# EAGLE design EIB_96Ch_YO (EAGLE 9.6.2)
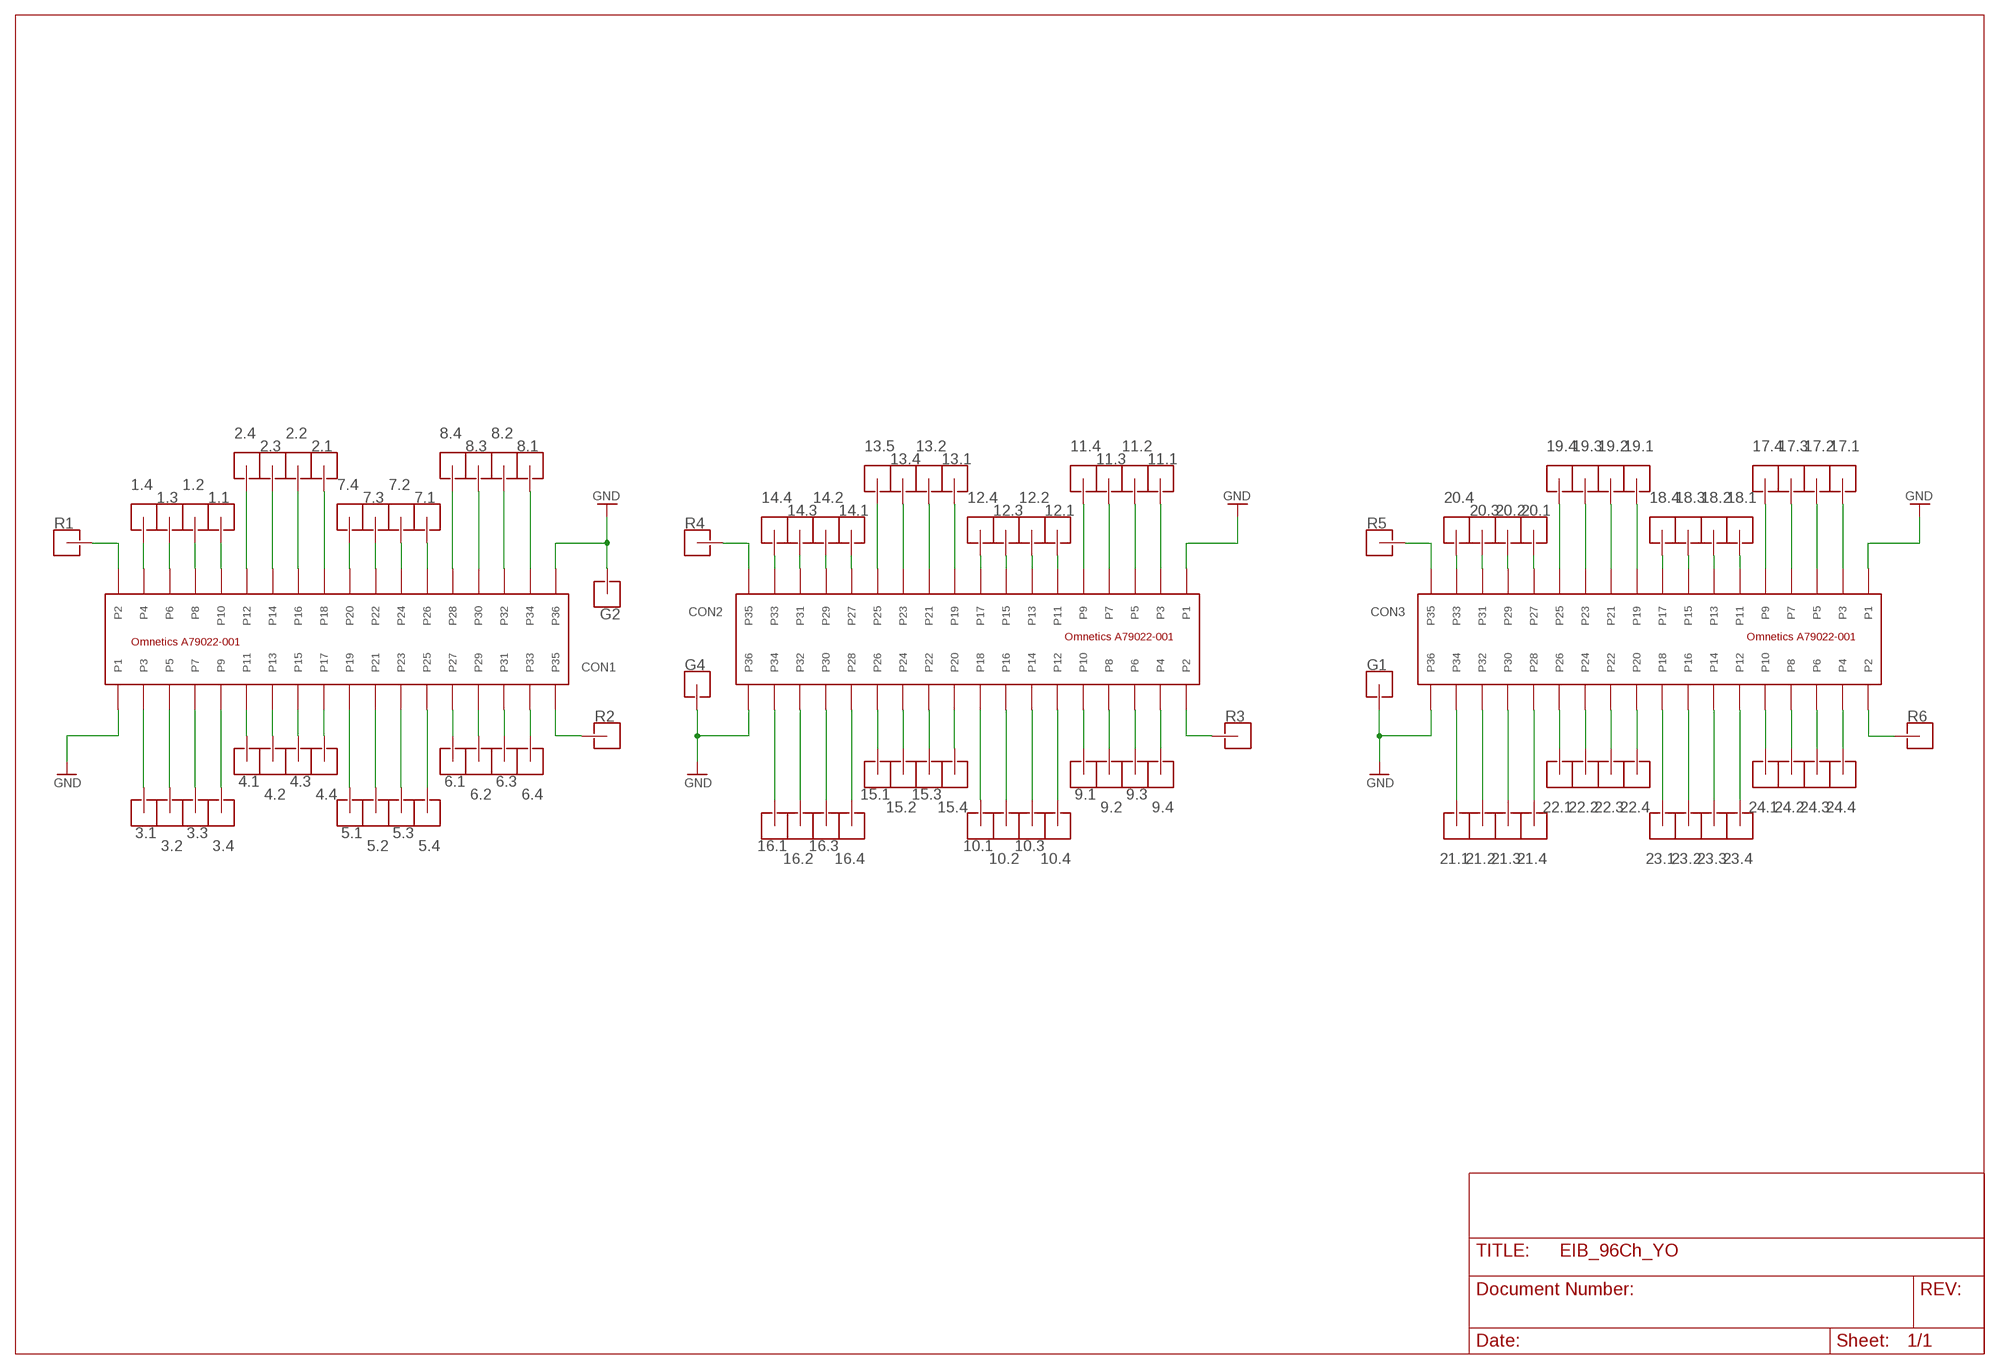
[diagram p0: schematic, sheet 1]

## Parts
1.1  HOLE_L_G_PIN_V5  [LARGE_GOLD_PIN_V5]
1.2  HOLE_L_G_PIN_V5  [LARGE_GOLD_PIN_V5]
1.3  HOLE_L_G_PIN_V5  [LARGE_GOLD_PIN_V5]
1.4  HOLE_L_G_PIN_V5  [LARGE_GOLD_PIN_V5]
2.1  HOLE_L_G_PIN_V5  [LARGE_GOLD_PIN_V5]
2.2  HOLE_L_G_PIN_V5  [LARGE_GOLD_PIN_V5]
2.3  HOLE_L_G_PIN_V5  [LARGE_GOLD_PIN_V5]
2.4  HOLE_L_G_PIN_V5  [LARGE_GOLD_PIN_V5]
3.1  HOLE_L_G_PIN_V5  [LARGE_GOLD_PIN_V5]
3.2  HOLE_L_G_PIN_V5  [LARGE_GOLD_PIN_V5]
3.3  HOLE_L_G_PIN_V5  [LARGE_GOLD_PIN_V5]
3.4  HOLE_L_G_PIN_V5  [LARGE_GOLD_PIN_V5]
4.1  HOLE_L_G_PIN_V5  [LARGE_GOLD_PIN_V5]
4.2  HOLE_L_G_PIN_V5  [LARGE_GOLD_PIN_V5]
4.3  HOLE_L_G_PIN_V5  [LARGE_GOLD_PIN_V5]
4.4  HOLE_L_G_PIN_V5  [LARGE_GOLD_PIN_V5]
5.1  HOLE_L_G_PIN_V5  [LARGE_GOLD_PIN_V5]
5.2  HOLE_L_G_PIN_V5  [LARGE_GOLD_PIN_V5]
5.3  HOLE_L_G_PIN_V5  [LARGE_GOLD_PIN_V5]
5.4  HOLE_L_G_PIN_V5  [LARGE_GOLD_PIN_V5]
6.1  HOLE_L_G_PIN_V5  [LARGE_GOLD_PIN_V5]
6.2  HOLE_L_G_PIN_V5  [LARGE_GOLD_PIN_V5]
6.3  HOLE_L_G_PIN_V5  [LARGE_GOLD_PIN_V5]
6.4  HOLE_L_G_PIN_V5  [LARGE_GOLD_PIN_V5]
7.1  HOLE_L_G_PIN_V5  [LARGE_GOLD_PIN_V5]
7.2  HOLE_L_G_PIN_V5  [LARGE_GOLD_PIN_V5]
7.3  HOLE_L_G_PIN_V5  [LARGE_GOLD_PIN_V5]
7.4  HOLE_L_G_PIN_V5  [LARGE_GOLD_PIN_V5]
8.1  HOLE_L_G_PIN_V5  [LARGE_GOLD_PIN_V5]
8.2  HOLE_L_G_PIN_V5  [LARGE_GOLD_PIN_V5]
8.3  HOLE_L_G_PIN_V5  [LARGE_GOLD_PIN_V5]
8.4  HOLE_L_G_PIN_V5  [LARGE_GOLD_PIN_V5]
9.1  HOLE_L_G_PIN_V5  [LARGE_GOLD_PIN_V5]
9.2  HOLE_L_G_PIN_V5  [LARGE_GOLD_PIN_V5]
9.3  HOLE_L_G_PIN_V5  [LARGE_GOLD_PIN_V5]
9.4  HOLE_L_G_PIN_V5  [LARGE_GOLD_PIN_V5]
10.1  HOLE_L_G_PIN_V5  [LARGE_GOLD_PIN_V5]
10.2  HOLE_L_G_PIN_V5  [LARGE_GOLD_PIN_V5]
10.3  HOLE_L_G_PIN_V5  [LARGE_GOLD_PIN_V5]
10.4  HOLE_L_G_PIN_V5  [LARGE_GOLD_PIN_V5]
11.1  HOLE_L_G_PIN_V5  [LARGE_GOLD_PIN_V5]
11.2  HOLE_L_G_PIN_V5  [LARGE_GOLD_PIN_V5]
11.3  HOLE_L_G_PIN_V5  [LARGE_GOLD_PIN_V5]
11.4  HOLE_L_G_PIN_V5  [LARGE_GOLD_PIN_V5]
12.1  HOLE_L_G_PIN_V5  [LARGE_GOLD_PIN_V5]
12.2  HOLE_L_G_PIN_V5  [LARGE_GOLD_PIN_V5]
12.3  HOLE_L_G_PIN_V5  [LARGE_GOLD_PIN_V5]
12.4  HOLE_L_G_PIN_V5  [LARGE_GOLD_PIN_V5]
13.1  HOLE_L_G_PIN_V5  [LARGE_GOLD_PIN_V5]
13.2  HOLE_L_G_PIN_V5  [LARGE_GOLD_PIN_V5]
13.4  HOLE_L_G_PIN_V5  [LARGE_GOLD_PIN_V5]
13.5  HOLE_L_G_PIN_V5  [LARGE_GOLD_PIN_V5]
14.1  HOLE_L_G_PIN_V5  [LARGE_GOLD_PIN_V5]
14.2  HOLE_L_G_PIN_V5  [LARGE_GOLD_PIN_V5]
14.3  HOLE_L_G_PIN_V5  [LARGE_GOLD_PIN_V5]
14.4  HOLE_L_G_PIN_V5  [LARGE_GOLD_PIN_V5]
15.1  HOLE_L_G_PIN_V5  [LARGE_GOLD_PIN_V5]
15.2  HOLE_L_G_PIN_V5  [LARGE_GOLD_PIN_V5]
15.3  HOLE_L_G_PIN_V5  [LARGE_GOLD_PIN_V5]
15.4  HOLE_L_G_PIN_V5  [LARGE_GOLD_PIN_V5]
16.1  HOLE_L_G_PIN_V5  [LARGE_GOLD_PIN_V5]
16.2  HOLE_L_G_PIN_V5  [LARGE_GOLD_PIN_V5]
16.3  HOLE_L_G_PIN_V5  [LARGE_GOLD_PIN_V5]
16.4  HOLE_L_G_PIN_V5  [LARGE_GOLD_PIN_V5]
17.1  HOLE_L_G_PIN_V5  [LARGE_GOLD_PIN_V5]
17.2  HOLE_L_G_PIN_V5  [LARGE_GOLD_PIN_V5]
17.3  HOLE_L_G_PIN_V5  [LARGE_GOLD_PIN_V5]
17.4  HOLE_L_G_PIN_V5  [LARGE_GOLD_PIN_V5]
18.1  HOLE_L_G_PIN_V5  [LARGE_GOLD_PIN_V5]
18.2  HOLE_L_G_PIN_V5  [LARGE_GOLD_PIN_V5]
18.3  HOLE_L_G_PIN_V5  [LARGE_GOLD_PIN_V5]
18.4  HOLE_L_G_PIN_V5  [LARGE_GOLD_PIN_V5]
19.1  HOLE_L_G_PIN_V5  [LARGE_GOLD_PIN_V5]
19.2  HOLE_L_G_PIN_V5  [LARGE_GOLD_PIN_V5]
19.3  HOLE_L_G_PIN_V5  [LARGE_GOLD_PIN_V5]
19.4  HOLE_L_G_PIN_V5  [LARGE_GOLD_PIN_V5]
20.1  HOLE_L_G_PIN_V5  [LARGE_GOLD_PIN_V5]
20.2  HOLE_L_G_PIN_V5  [LARGE_GOLD_PIN_V5]
20.3  HOLE_L_G_PIN_V5  [LARGE_GOLD_PIN_V5]
20.4  HOLE_L_G_PIN_V5  [LARGE_GOLD_PIN_V5]
21.1  HOLE_L_G_PIN_V5  [LARGE_GOLD_PIN_V5]
21.2  HOLE_L_G_PIN_V5  [LARGE_GOLD_PIN_V5]
21.3  HOLE_L_G_PIN_V5  [LARGE_GOLD_PIN_V5]
21.4  HOLE_L_G_PIN_V5  [LARGE_GOLD_PIN_V5]
22.1  HOLE_L_G_PIN_V5  [LARGE_GOLD_PIN_V5]
22.2  HOLE_L_G_PIN_V5  [LARGE_GOLD_PIN_V5]
22.3  HOLE_L_G_PIN_V5  [LARGE_GOLD_PIN_V5]
22.4  HOLE_L_G_PIN_V5  [LARGE_GOLD_PIN_V5]
23.1  HOLE_L_G_PIN_V5  [LARGE_GOLD_PIN_V5]
23.2  HOLE_L_G_PIN_V5  [LARGE_GOLD_PIN_V5]
23.3  HOLE_L_G_PIN_V5  [LARGE_GOLD_PIN_V5]
23.4  HOLE_L_G_PIN_V5  [LARGE_GOLD_PIN_V5]
24.1  HOLE_L_G_PIN_V5  [LARGE_GOLD_PIN_V5]
24.2  HOLE_L_G_PIN_V5  [LARGE_GOLD_PIN_V5]
24.3  HOLE_L_G_PIN_V5  [LARGE_GOLD_PIN_V5]
24.4  HOLE_L_G_PIN_V5  [LARGE_GOLD_PIN_V5]
CON1  A79022-001_MALESMD  [A79026-001_MALE]
CON2  A79022-001_MALESMD  [A79026-001_MALE]
CON3  A79022-001_MALESMD  [A79026-001_MALE]
G1  HOLE_L_G_PIN_V5  [LARGE_GOLD_PIN_V5]
G2  HOLE_L_G_PIN_V5  [LARGE_GOLD_PIN_V5]
G4  HOLE_L_G_PIN_V5  [LARGE_GOLD_PIN_V5]
R1  HOLE_L_G_PIN_V5  [LARGE_GOLD_PIN_V5]
R2  HOLE_L_G_PIN_V5  [LARGE_GOLD_PIN_V5]
R3  HOLE_L_G_PIN_V5  [LARGE_GOLD_PIN_V5]
R4  HOLE_L_G_PIN_V5  [LARGE_GOLD_PIN_V5]
R5  HOLE_L_G_PIN_V5  [LARGE_GOLD_PIN_V5]
R6  HOLE_L_G_PIN_V5  [LARGE_GOLD_PIN_V5]

## Nets
GND: CON1.P1 CON1.P36 CON2.P1 CON2.P36 CON3.P1 CON3.P36 G1.P$1 G2.P$1 G4.P$1
N$1: 11.2.P$1 CON2.P5
N$2: 11.3.P$1 CON2.P7
N$3: 11.4.P$1 CON2.P9
N$4: 14.4.P$1 CON2.P33
N$5: 16.2.P$1 CON2.P32
N$6: 16.1.P$1 CON2.P34
N$7: 12.1.P$1 CON2.P11
N$8: 16.3.P$1 CON2.P30
N$9: 12.4.P$1 CON2.P17
N$10: 13.1.P$1 CON2.P19
N$11: 15.4.P$1 CON2.P20
N$12: 10.4.P$1 CON2.P12
N$13: 12.2.P$1 CON2.P13
N$14: 12.3.P$1 CON2.P15
N$15: 13.2.P$1 CON2.P21
N$16: 13.4.P$1 CON2.P23
N$17: 13.5.P$1 CON2.P25
N$18: 14.1.P$1 CON2.P27
N$19: 14.2.P$1 CON2.P29
N$20: 14.3.P$1 CON2.P31
N$21: 10.1.P$1 CON2.P18
N$22: 11.1.P$1 CON2.P3
N$23: 9.4.P$1 CON2.P4
N$24: 9.3.P$1 CON2.P6
N$25: 9.2.P$1 CON2.P8
N$26: 10.3.P$1 CON2.P14
N$27: 10.2.P$1 CON2.P16
N$28: 9.1.P$1 CON2.P10
N$29: 16.4.P$1 CON2.P28
N$30: 15.1.P$1 CON2.P26
N$31: 15.3.P$1 CON2.P22
N$32: 15.2.P$1 CON2.P24
N$33: CON1.P2 R1.P$1
N$34: CON2.P2 R3.P$1
N$35: CON2.P35 R4.P$1
N$36: CON1.P35 R2.P$1
N$37: 3.2.P$1 CON1.P5
N$38: 3.3.P$1 CON1.P7
N$39: 3.4.P$1 CON1.P9
N$40: 4.1.P$1 CON1.P11
N$41: 4.2.P$1 CON1.P13
N$42: 4.3.P$1 CON1.P15
N$43: 5.2.P$1 CON1.P21
N$44: 5.3.P$1 CON1.P23
N$45: 5.4.P$1 CON1.P25
N$46: 7.4.P$1 CON1.P20
N$47: 7.3.P$1 CON1.P22
N$48: 7.2.P$1 CON1.P24
N$49: 4.4.P$1 CON1.P17
N$50: 5.1.P$1 CON1.P19
N$51: 7.1.P$1 CON1.P26
N$52: 2.1.P$1 CON1.P18
N$53: 3.1.P$1 CON1.P3
N$54: 1.4.P$1 CON1.P4
N$55: 1.3.P$1 CON1.P6
N$56: 1.2.P$1 CON1.P8
N$57: 2.4.P$1 CON1.P12
N$58: 2.3.P$1 CON1.P14
N$59: 2.2.P$1 CON1.P16
N$60: 1.1.P$1 CON1.P10
N$61: 6.4.P$1 CON1.P33
N$62: 6.1.P$1 CON1.P27
N$63: 6.2.P$1 CON1.P29
N$64: 6.3.P$1 CON1.P31
N$65: 8.1.P$1 CON1.P34
N$66: 8.2.P$1 CON1.P32
N$67: 8.3.P$1 CON1.P30
N$68: 8.4.P$1 CON1.P28
N$69: 20.4.P$1 CON3.P33
N$70: CON3.P35 R5.P$1
N$71: 20.3.P$1 CON3.P31
N$72: 20.2.P$1 CON3.P29
N$73: 20.1.P$1 CON3.P27
N$74: 19.4.P$1 CON3.P25
N$75: 19.3.P$1 CON3.P23
N$76: 19.2.P$1 CON3.P21
N$77: 19.1.P$1 CON3.P19
N$78: 18.4.P$1 CON3.P17
N$79: 18.3.P$1 CON3.P15
N$80: 18.2.P$1 CON3.P13
N$81: 18.1.P$1 CON3.P11
N$82: 17.4.P$1 CON3.P9
N$83: 17.3.P$1 CON3.P7
N$84: 17.2.P$1 CON3.P5
N$85: 17.1.P$1 CON3.P3
N$87: CON3.P2 R6.P$1
N$88: 24.4.P$1 CON3.P4
N$89: 24.3.P$1 CON3.P6
N$90: 24.2.P$1 CON3.P8
N$91: 24.1.P$1 CON3.P10
N$92: 23.4.P$1 CON3.P12
N$93: 23.3.P$1 CON3.P14
N$94: 23.2.P$1 CON3.P16
N$95: 23.1.P$1 CON3.P18
N$96: 22.4.P$1 CON3.P20
N$98: 22.3.P$1 CON3.P22
N$99: 22.2.P$1 CON3.P24
N$100: 22.1.P$1 CON3.P26
N$101: 21.4.P$1 CON3.P28
N$102: 21.3.P$1 CON3.P30
N$103: 21.2.P$1 CON3.P32
N$104: 21.1.P$1 CON3.P34

## Library data of the parts
1.1-1.4 2.1-2.4 3.1-3.4 4.1-4.4 5.1-5.4 6.1-6.4 7.1-7.4 8.1-8.4 9.1-9.4 10.1-10.4 11.1-11.4 12.1-12.4 13.1 13.2 13.4 13.5 14.1-14.4 15.1-15.4 16.1-16.4 17.1-17.4 18.1-18.4 19.1-19.4 20.1-20.4 21.1-21.4 22.1-22.4 23.1-23.4 24.1-24.4 G1 G2 G4 R1-R6 = pin and holes:HOLE
CON1-CON3 = omnetics:A79022-001_MALE

## Board
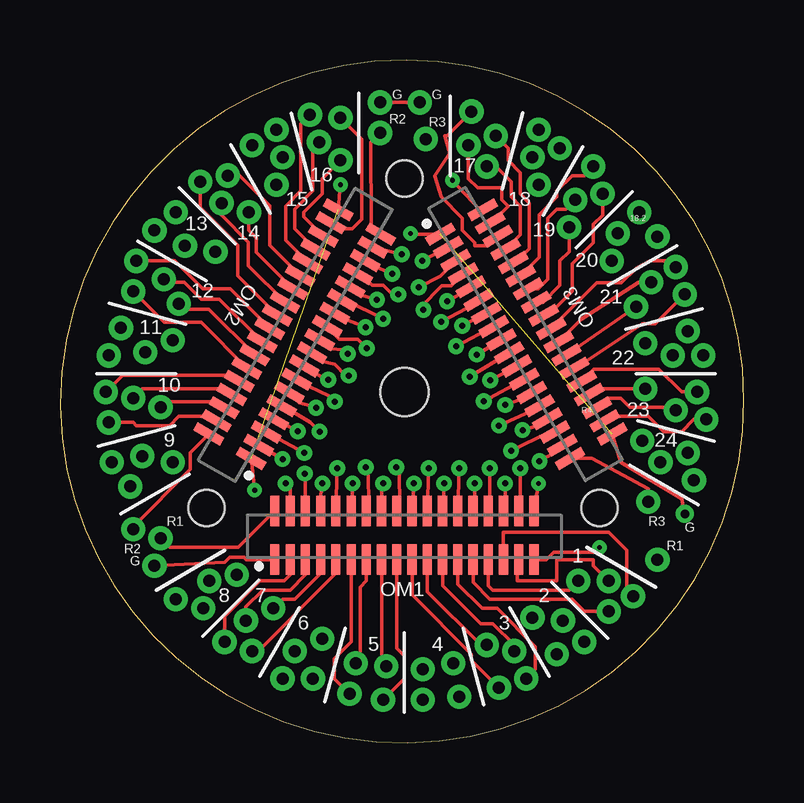
[diagram p1: board, top side]
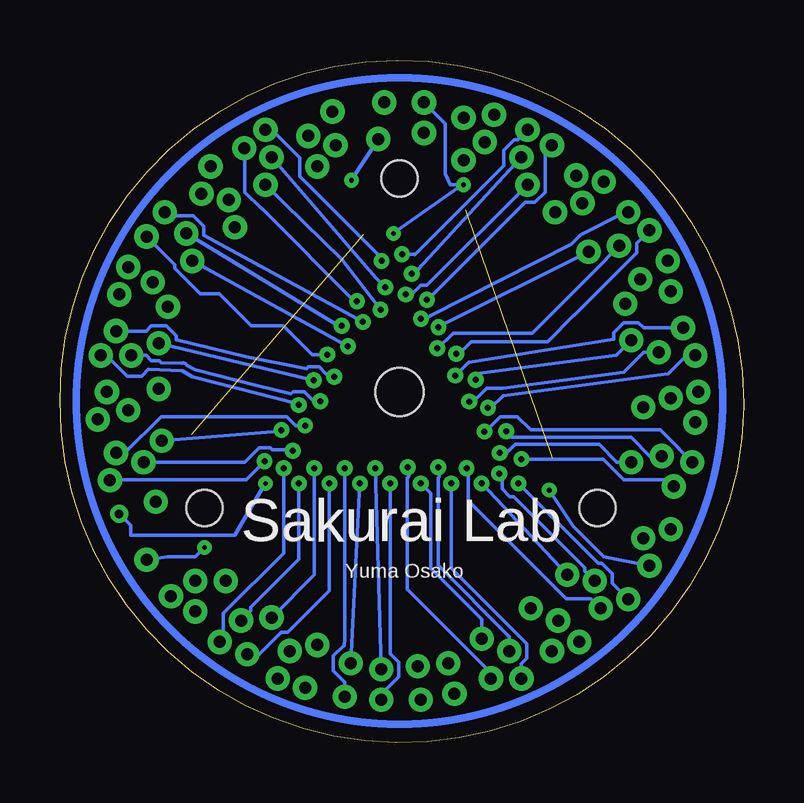
[diagram p2: board, bottom side, seen from below]

Size 28.5 x 28.44 mm. Coordinates in mm from the lower left corner, seen from the top.
Outline: 14.45,28.44 arc90 0,14.11 0,13.98 arc90 14.49,0 arc90 28.5,14.26 arc90 14.45,28.44
Copper layers (1*16): Top 0.035mm / dielectric 1.5mm / Bottom 0.035mm
Design rules "default": minimum track width 6mil, minimum drill 0.35mm, track to track 6mil, track to pad 6mil, pad to pad 6mil, via to via 6mil, smd to smd 6mil, copper to edge 40mil, drill to drill 6mil, minimum pad ring 10mil, minimum via ring 8mil, stop-mask expansion 4mil, vias tented up to drill 0mil, thermal gap 10mil
Holes 2 mm at 14.35,14.6
Holes 1.5 mm at 6.1,9.78 22.48,9.78 14.35,23.49

### Footprints (pad centres in the part's own frame; a part is rotated, then mirrored left to right if it is on the bottom)
LARGE_GOLD_PIN_V5 = drill 0.5 pad 0.8: P$1 0,0
A79026-001_MALE = smd 0.381 x 1.27: P1 -5.397,-1.016; P2 -5.397,1.016; P3 -4.763,-1.016; P4 -4.763,1.016; P5 -4.128,-1.016; P6 -4.128,1.016; P7 -3.493,-1.016; P8 -3.493,1.016; P9 -2.857,-1.016; P10 -2.857,1.016; P11 -2.223,-1.016; P12 -2.223,1.016; P13 -1.587,-1.016; P14 -1.587,1.016; P15 -0.953,-1.016; P16 -0.953,1.016; P17 -0.318,-1.016; P18 -0.318,1.016; P19 0.318,-1.016; P20 0.318,1.016; P21 0.953,-1.016; P22 0.953,1.016; P23 1.587,-1.016; P24 1.587,1.016; P25 2.223,-1.016; P26 2.223,1.016; P27 2.857,-1.016; P28 2.857,1.016; P29 3.493,-1.016; P30 3.493,1.016; P31 4.128,-1.016; P32 4.128,1.016; P33 4.763,-1.016; P34 4.763,1.016; P35 5.397,-1.016; P36 5.397,1.016

### Placement (x,y rotation side)
1.1  5.97,5.59 0 top
1.2  7.37,6.98 0 top
1.3  6.22,6.73 0 top
1.4  4.83,5.97 0 top
2.1  10.54,2.67 0 top
2.2  10.92,4.32 0 top
2.3  9.78,3.81 0 top
2.4  9.27,2.67 0 top
3.1  6.86,4.19 0 top
3.2  7.75,5.08 0 top
3.3  8.89,5.59 0 top
3.4  8,3.81 0 top
4.1  12.06,2.03 0 top
4.2  12.32,3.3 0 top
4.3  13.59,3.18 0 top
4.4  13.46,1.78 0 top
5.1  18.29,2.29 0 top
5.2  17.78,4.06 0 top
5.3  18.92,3.81 0 top
5.4  19.43,2.67 0 top
6.1  22.86,5.46 0 top
6.2  21.59,6.73 0 top
6.3  23.88,6.1 0 top
6.4  22.86,6.73 0 top
7.1  16.64,1.9 0 top
7.2  16.38,3.3 0 top
7.3  15.11,3.05 0 top
7.4  15.11,1.78 0 top
8.1  21.84,4.19 0 top
8.2  20.95,5.08 0 top
8.3  19.69,5.21 0 top
8.4  20.7,3.68 0 top
9.1  1.91,14.6 0 top
9.2  3.05,14.35 0 top
9.3  4.19,13.97 0 top
9.4  2.03,13.34 0 top
10.1  3.17,20.07 0 top
10.2  4.32,19.3 0 top
10.3  4.95,18.29 0 top
10.4  3.05,18.8 0 top
11.1  2.92,10.67 0 top
11.2  4.7,11.68 0 top
11.3  3.43,11.94 0 top
11.4  2.16,11.68 0 top
12.1  2.03,16.13 0 top
12.2  3.56,16.26 0 top
12.3  4.7,16.76 0 top
12.4  2.54,17.27 0 top
13.1  3.94,21.34 0 top
13.2  5.21,20.7 0 top
13.4  6.48,20.45 0 top
13.5  4.83,22.1 0 top
14.1  8,24.89 0 top
14.2  9.02,23.24 0 top
14.3  9.27,24.38 0 top
14.4  9.02,25.53 0 top
15.1  6.98,23.62 0 top
15.2  7.87,22.1 0 top
15.3  6.73,22.48 0 top
15.4  5.84,23.37 0 top
16.1  11.68,26.03 0 top
16.2  11.68,24.26 0 top
16.3  10.8,25.02 0 top
16.4  10.41,26.16 0 top
17.1  19.94,25.53 0 top
17.2  19.69,24.38 0 top
17.3  19.94,23.24 0 top
17.4  20.83,24.77 0 top
18.1  24.13,22.1 0 top
18.2  23.24,21.21 0 top
18.3  22.99,20.07 0 top
18.4  24.89,21.08 0 top
19.1  26.16,17.14 0 top
19.2  24.38,16.64 0 top
19.3  25.53,16.13 0 top
19.4  26.8,16.13 0 top
20.1  26.16,12.06 0 top
20.2  24.26,12.57 0 top
20.3  25.02,11.68 0 top
20.4  26.42,10.92 0 top
21.1  26.92,13.46 0 top
21.2  25.65,13.84 0 top
21.3  24.38,14.73 0 top
21.4  26.54,14.6 0 top
22.1  26.03,18.67 0 top
22.2  24,18.16 0 top
22.3  24.64,19.18 0 top
22.4  25.65,19.81 0 top
23.1  22.61,22.86 0 top
23.2  21.21,21.46 0 top
23.3  21.46,22.61 0 top
23.4  22.23,24 0 top
24.1  18.16,25.27 0 top
24.2  17.78,24 0 top
24.3  17.14,26.29 0 top
24.4  17.02,24.89 0 top
CON1  14.35,8.64 0 top
CON2  9.78,17.02 60 top
CON3  19.43,17.02 300 top
G1  14.99,26.67 0 top
G2  13.34,26.67 0 top
G4  3.94,7.37 0 top
R1  4.19,8.51 0 top
R2  24.89,7.62 0 top
R3  3.05,8.89 0 top
R4  13.34,25.4 0 top
R5  24.51,10.03 0 top
R6  15.24,25.15 0 top

### Tracks (layer width: path | path; a pad name or v marks a point on that pad's centre or on a via)
GND  (via drill 0.2, 0.35)  (2 unrouted)
  Top 0.152: G4.P$1 6.86,7.51 7.06,7.72 7.67,7.72 7.77,7.62 CON1.P1 | CON1.P36 v19.94,10.79 | v11.68,23.24 CON2.P36 | G2.P$1 G1.P$1 | CON3.P1 14.61,21.18 v14.6,21.21 | CON3.P36 23.37,11.68 25.91,10.16 v26.03,9.52 | CON2.P1 v8.12,10.51 v8.11,10.52
  Bottom 0.152: G2.P$1 12.45,25.78 12.45,23.69 12.23,23.24 v11.68,23.24 11.74,23.24 v14.6,21.21 | v26.03,9.52 25.55,9.04 25.55,8.64 21.21,8.64 v19.94,10.79 | v8.11,10.52 7.11,9.01 5.84,7.75 G4.P$1
N$1  (via drill 0.25)
  Top 0.152: v10.18,12.06 CON2.P5
  Bottom 0.152: 11.2.P$1 5.3,11.68 6.04,12.42 9.52,12.42 9.88,12.06 v10.18,12.06
N$2  (via drill 0.25)
  Top 0.152: v9.91,12.97 CON2.P7
  Bottom 0.152: 11.3.P$1 3.92,11.94 4.7,12.72 9.67,12.72 9.78,12.83 9.78,12.97 v9.91,12.97
N$3  (via drill 0.25)
  Top 0.152: v10.81,12.95 10.43,13.34 9.27,14.03 CON2.P9
  Bottom 0.152: 11.4.P$1 2.7,12.22 2.7,12.24 3.48,13.03 8.89,13.03 9.45,13.58 10.16,13.58 10.78,12.95 v10.81,12.95
N$4  (via drill 0.25)
  Top 0.152: v14.24,20.34 CON2.P33
  Bottom 0.152: 14.4.P$1 9.43,25.12 9.57,25.12 10,24.69 10,24.03 13.72,20.32 13.74,20.34 v14.24,20.34
N$5
  Top 0.152: 16.2.P$1 10.92,23.49 10.92,22.86 10.16,22.1 10.16,21.9 CON2.P32
N$6
  Top 0.152: 16.1.P$1 12.57,25.15 12.57,21.8 12.17,21.4 11.53,21.4 CON2.P34
N$7  (via drill 0.25)
  Top 0.152: v10.67,13.95 10.65,13.97 9.98,14.16 CON2.P11
  Bottom 0.152: 12.1.P$1 2.39,16.13 3.16,15.36 10.03,14.46 10.54,13.95 v10.67,13.95
N$8
  Top 0.152: 16.3.P$1 10.54,24.77 10.54,22.99 9.78,22.23 9.78,21.42 CON2.P30
N$9  (via drill 0.25)
  Top 0.152: v12.03,15.29 11.9,15.29 11.44,15.75 10.82,15.92 CON2.P17
  Bottom 0.152: v12.03,15.29 11.47,15.85 11.45,15.85 5.43,16.81 5.43,17.07 5,17.5 4.4,17.5 4.17,17.27 12.4.P$1
N$10  (via drill 0.25)
  Top 0.152: v11.99,16.2 11.86,16.36 11.2,16.4 CON2.P19
  Bottom 0.152: 13.1.P$1 4.47,20.8 4.47,20.4 7.06,17.81 7.08,17.81 8.19,16.71 11.36,16.71 11.86,16.2 v11.99,16.2
N$11
  Top 0.152: 15.4.P$1 5.84,22.29 7.41,20.72 7.41,19.45 CON2.P20
N$12
  Top 0.152: 10.4.P$1 4.34,17.51 5.88,17.51 CON2.P12
N$13  (via drill 0.25)
  Top 0.152: v11.45,14.2 11.2,14.46 9.96,15.04 CON2.P13
  Bottom 0.152: 12.2.P$1 4.17,16.26 5,15.42 10.05,14.76 10.71,14.76 11.12,14.35 11.45,14.35 v11.45,14.2
N$14  (via drill 0.25)
  Top 0.152: v11.18,15.11 11.15,15.09 10.26,15.6 CON2.P15
  Bottom 0.152: v11.18,15.11 11.18,15.37 5.33,16.13 12.3.P$1
N$15  (via drill 0.25)
  Top 0.152: v12.78,16.42 12.4,16.81 11.64,16.81 11.13,17.31 11.11,17.31 CON2.P21
  Bottom 0.152: 13.2.P$1 5.74,20.16 5.74,20.14 8.83,17.06 12.12,17.06 12.75,16.42 v12.78,16.42
N$16  (via drill 0.25)
  Top 0.152: v12.73,17.3 11.58,17.76 CON2.P23
  Bottom 0.152: 13.4.P$1 12.73,17.32 v12.73,17.3
N$17  (via drill 0.25)
  Top 0.152: v13.46,17.65 11.9,18.44 CON2.P25
  Bottom 0.152: 13.5.P$1 4.95,22.1 6.8,21.16 7.19,20.77 13.08,17.78 13.21,17.65 v13.46,17.65
N$18  (via drill 0.25)
  Top 0.152: v13.21,18.45 12.36,18.71 CON2.P27
  Bottom 0.152: 14.1.P$1 8.28,24.61 8.28,22.94 8.71,22.51 9.12,22.51 13.17,18.45 v13.21,18.45
N$19  (via drill 0.25)
  Top 0.152: v14.1,18.67 13.84,18.67 13.46,19.05 13.02,19.05 12.53,19.53 CON2.P29
  Bottom 0.152: 14.2.P$1 13.21,19.05 13.46,19.05 13.84,18.67 v14.1,18.67
N$20  (via drill 0.25)
  Top 0.152: v13.84,19.53 12.85,19.96 CON2.P31
  Bottom 0.152: 14.3.P$1 13.84,19.42 v13.84,19.53
N$21
  Top 0.152: 10.1.P$1 4.78,20.07 5.95,18.9 7.09,18.9 CON2.P18
N$22  (via drill 0.25)
  Top 0.152: v9.27,11.81 CON2.P3
  Bottom 0.152: 11.1.P$1 3.2,10.95 5,10.95 5.86,11.81 v9.27,11.81
N$23
  Top 0.152: 9.4.P$1 3.05,13.34 3.17,13.21 4.57,13.21 4.95,13.59 6.33,13.59 CON2.P4
N$24
  Top 0.152: 9.3.P$1 4.43,14.2 6.58,14.2 CON2.P6
N$25
  Top 0.152: CON2.P8 6.92,14.73 3.43,14.73 9.2.P$1
N$26
  Top 0.152: CON2.P14 6.2,18.05 5.19,18.05 10.3.P$1
N$27
  Top 0.152: 10.2.P$1 4.45,19.18 5.19,19.18 5.88,18.48 6.64,18.48 CON2.P16
N$28
  Top 0.152: 9.1.P$1 2.6,15.3 7.22,15.3 CON2.P10
N$29
  Top 0.152: 16.4.P$1 10.03,25.78 10.03,22.99 9.4,22.35 9.4,20.93 CON2.P28
N$30
  Top 0.152: 15.1.P$1 7.49,23.62 8.74,22.38 8.74,20.72 CON2.P26
N$31
  Top 0.152: 15.3.P$1 6.73,21.97 7.85,20.85 7.85,19.88 CON2.P22
N$32
  Top 0.152: 15.2.P$1 7.87,21.34 8.17,21.04 8.17,20.42 CON2.P24
N$33
  Top 0.152: CON1.P2 7.43,8.13 4.57,8.13 R1.P$1
N$34
  Top 0.152: R3.P$1 3.05,9 5.43,11.38 5.43,12.08 CON2.P2
N$35
  Top 0.152: R4.P$1 12.96,25.02 12.98,21.57 CON2.P35
N$36  (via drill 0.2)
  Top 0.152: v22.48,8.13 22.28,7.93 20.57,7.93 20.27,7.62 CON1.P35
  Bottom 0.152: R2.P$1 24,7.75 22.86,7.75 v22.48,8.13
N$37
  Top 0.152: CON1.P5 10.22,6.98 9.59,6.35 8.45,6.35 7.75,5.65 3.2.P$1
N$38
  Top 0.152: 3.3.P$1 9.27,5.97 9.78,5.97 10.86,7.05 CON1.P7
N$39
  Top 0.152: 3.4.P$1 8.25,3.81 11.49,7.05 CON1.P9
N$40
  Top 0.152: 4.1.P$1 11.43,2.67 11.43,3.49 12.13,4.19 CON1.P11
N$41
  Top 0.152: 4.2.P$1 12.51,3.49 12.51,6.48 12.76,6.73 CON1.P13
N$42
  Top 0.152: 4.3.P$1 13.4,3.37 CON1.P15
N$43
  Top 0.152: 5.2.P$1 17.53,4.06 15.3,6.29 CON1.P21
N$44
  Top 0.152: 5.3.P$1 18.92,4.06 18.03,4.95 17.53,4.95 15.94,6.54 CON1.P23
N$45
  Top 0.152: 5.4.P$1 19.81,3.05 19.81,4 18.23,5.59 17.59,5.59 16.57,6.6 CON1.P25
N$46  (via drill 0.25)
  Top 0.152: v14.75,10.79 CON1.P20
  Bottom 0.152: 7.4.P$1 15.11,2.01 14.38,2.75 14.38,3.35 14.73,3.7 14.73,10.79 v14.75,10.79
N$47  (via drill 0.25)
  Top 0.152: v15.37,11.43 CON1.P22
  Bottom 0.152: 7.3.P$1 v15.37,11.43
N$48  (via drill 0.25)
  Top 0.152: v16,10.79 CON1.P24
  Bottom 0.152: 7.2.P$1 v16,10.79
N$49
  Top 0.152: 4.4.P$1 14.35,2.67 14.35,3.62 14.03,3.94 CON1.P17
N$50
  Top 0.152: 5.1.P$1 17.14,3.43 17.14,3.68 14.67,6.16 CON1.P19
N$51  (via drill 0.25)
  Top 0.152: v16.64,11.43 CON1.P26
  Bottom 0.152: v16.64,11.43 16.64,4.31 16.65,4.04 16.69,4.04 17.12,3.61 17.12,3 16.64,2.52 7.1.P$1
N$52  (via drill 0.25)
  Top 0.152: CON1.P18 14.16,9.77 14.13,11.34 v14.01,11.47
  Bottom 0.152: 2.1.P$1 10.54,2.9 14.02,6.38 14.02,11.03 13.97,11.08 13.97,11.43 v14.01,11.47
N$53
  Top 0.152: 3.1.P$1 6.86,5.27 8.32,6.73 9.33,6.73 9.59,6.98 CON1.P3
N$54  (via drill 0.25)
  Top 0.152: v9.4,10.79 9.59,10.79 CON1.P4
  Bottom 0.152: 1.4.P$1 5.49,6.63 5.49,7.03 5.92,7.46 6.07,7.46 v9.4,10.79
N$55  (via drill 0.25)
  Top 0.152: v10.2,11.21 10.22,11.2 CON1.P6
  Bottom 0.152: 1.3.P$1 6.63,7.14 6.63,7.29 9.58,10.24 9.76,10.24 10.08,10.56 10.08,11.1 v10.2,11.21
N$56  (via drill 0.25)
  Top 0.152: v10.93,10.79 10.86,10.32 CON1.P8
  Bottom 0.152: 1.2.P$1 v10.93,10.79
N$57  (via drill 0.25)
  Top 0.152: v12.19,10.79 12.13,9.78 CON1.P12
  Bottom 0.152: 2.4.P$1 9.27,3.28 9.05,3.51 9.05,4.11 12.19,7.26 v12.19,10.79
N$58  (via drill 0.25)
  Top 0.152: CON1.P14 12.87,9.76 12.85,11.35 v12.74,11.47
  Bottom 0.152: 2.3.P$1 9.78,4.41 12.75,7.38 12.75,11.03 12.7,11.07 12.7,11.43 v12.74,11.47
N$59  (via drill 0.25)
  Top 0.152: CON1.P16 13.4,10.79 v13.46,10.79
  Bottom 0.152: 2.2.P$1 10.92,5.13 13.05,7.26 13.05,10.39 v13.46,10.79
N$60  (via drill 0.25)
  Top 0.152: v11.56,11.43 CON1.P10
  Bottom 0.152: 1.1.P$1 6.38,6 7.41,6 11.49,10.07 11.49,11.36 v11.56,11.43
N$61
  Top 0.152: 6.4.P$1 22.23,7.37 22.23,7.62 20.7,7.62 20.7,6.73 19.05,6.73 19.05,7.56 CON1.P33
N$62
  Top 0.152: 6.1.P$1 21.84,5.46 21.34,5.97 17.91,5.97 17.21,6.67 CON1.P27
N$63
  Top 0.152: 6.2.P$1 21.21,6.35 18.03,6.35 17.84,6.54 CON1.P29
N$64
  Top 0.152: 6.3.P$1 23.62,6.35 23.62,8 22.86,8.76 18.48,8.76 CON1.P31
N$65  (via drill 0.25)
  Top 0.152: v19.18,11.43 19.18,9.71 CON1.P34
  Bottom 0.152: 8.1.P$1 21.69,4.35 21.69,5.38 19.18,7.89 v19.18,11.43
N$66  (via drill 0.25)
  Top 0.152: v18.54,10.79 18.54,9.71 CON1.P32
  Bottom 0.152: 8.2.P$1 20.55,5.49 20.55,5.64 18.54,7.64 v18.54,10.79
N$67  (via drill 0.25)
  Top 0.152: v17.91,11.43 17.91,9.71 CON1.P30
  Bottom 0.152: 8.3.P$1 17.91,6.98 v17.91,11.43
N$68  (via drill 0.25)
  Top 0.152: v17.27,10.79 17.27,9.71 CON1.P28
  Bottom 0.152: 8.4.P$1 20.19,3.68 19.27,4.6 19,4.6 17.27,6.33 v17.27,10.79
N$69  (via drill 0.25)
  Top 0.152: CON3.P33 20.64,12.09 v19.98,11.72
  Bottom 0.152: 20.4.P$1 26.39,10.95 20.74,10.95 v19.98,11.72
N$70
  Top 0.152: CON3.P35 22.16,11.84 24.51,10.57 R5.P$1
N$71  (via drill 0.25)
  Top 0.152: CON3.P31 20.36,12.94 v18.8,12.16
  Bottom 0.152: 20.3.P$1 20.8,11.68 20.2,12.28 19.74,12.28 19.66,12.19 18.8,12.19 v18.8,12.16
N$72  (via drill 0.25)
  Top 0.152: CON3.P29 20.06,13.25 v19.27,13.02
  Bottom 0.152: 20.2.P$1 19.36,12.96 v19.27,13.02
N$73  (via drill 0.25)
  Top 0.152: CON3.P27 19.85,13.91 v18.29,13.21
  Bottom 0.152: 20.1.P$1 25.8,12.06 24.29,13.58 19.04,13.58 18.67,13.21 v18.29,13.21
N$74  (via drill 0.25)
  Top 0.152: v18.55,14.07 19.47,14.39 CON3.P25
  Bottom 0.152: v18.55,14.07 18.6,14.11 22.99,15.24 23.41,15.49 24.82,15.54 25.1,15.27 25.7,15.27 26.56,16.13 19.4.P$1
N$75  (via drill 0.25)
  Top 0.152: v17.65,14.22 CON3.P23
  Bottom 0.152: 19.3.P$1 24.91,16.13 24.69,15.9 24.36,15.9 24.29,15.83 23.44,15.8 23.36,15.82 23.31,15.79 23.27,15.79 23.21,15.73 22.87,15.52 20.35,14.88 18.88,14.52 18.78,14.62 18.32,14.62 17.92,14.22 v17.65,14.22
N$76  (via drill 0.25)
  Top 0.152: v17.93,15.09 CON3.P21
  Bottom 0.152: 19.2.P$1 18.03,15.11 v17.93,15.09
N$77  (via drill 0.25)
  Top 0.152: v17.07,15.24 CON3.P19
  Bottom 0.152: 19.1.P$1 24.91,17.14 24.69,17.37 24.08,17.37 23.65,16.94 23.65,16.77 20.74,16.08 18.23,15.58 18.16,15.65 17.7,15.65 17.42,15.37 17.14,15.37 v17.07,15.24
N$78  (via drill 0.25)
  Top 0.152: v17.36,16.17 CON3.P17
  Bottom 0.152: 18.4.P$1 23.72,19.91 23.72,19.76 22.66,18.7 21.87,18.7 20.54,17.36 19.19,17.36 18,16.17 v17.36,16.17
N$79  (via drill 0.25)
  Top 0.152: v16.5,16.51 CON3.P15
  Bottom 0.152: 18.3.P$1 v16.51,16.51 v16.5,16.51
N$80  (via drill 0.25)
  Top 0.152: v16.76,17.37 CON3.P13
  Bottom 0.152: 18.2.P$1 16.76,17.27 v16.76,17.37
N$81  (via drill 0.25)
  Top 0.152: CON3.P11 17.29,18.29 v15.88,17.53
  Bottom 0.152: v15.88,17.53 22.51,21.14 22.51,21.51 22.94,21.94 23.97,21.94 18.1.P$1
N$82  (via drill 0.25)
  Top 0.152: CON3.P9 16.99,18.86 v16.13,18.38
  Bottom 0.152: 17.4.P$1 20.8,24.74 20.8,22.94 20.12,22.25 20.09,22.25 16.13,18.29 v16.13,18.38
N$83  (via drill 0.25)
  Top 0.152: CON3.P7 16.3,19.03 15.92,19.03 15.03,18.14 v15.14,18.03
  Bottom 0.152: 17.3.P$1 16.75,20.15 v15.14,18.03
N$84  (via drill 0.25)
  Top 0.152: v14.95,18.97 15.84,19.44 CON3.P5
  Bottom 0.152: v14.95,18.97 15.35,19.37 17.2.P$1
N$85  (via drill 0.25)
  Top 0.152: v15.1,20.07 CON3.P3
  Bottom 0.152: 17.1.P$1 19.91,25.5 19.64,25.5 18.51,24.38 18.51,23.59 14.99,20.07 v15.1,20.07
N$87  (via drill 0.2)
  Top 0.152: CON3.P2 17.49,22.2 16.32,23.44 v16.35,23.43
  Bottom 0.152: R6.P$1 v16.35,23.43
N$88
  Top 0.152: 24.4.P$1 17.02,23.49 17.4,23.11 18.41,23.11 18.41,22.61 18.67,22.35 17.97,21.65 CON3.P4
N$89
  Top 0.152: 24.3.P$1 16.13,25.27 16.04,25.27 16.24,24.55 15.62,23.62 15.88,22.73 16.76,21.84 16.76,21.34 17.27,20.83 17.27,20.7 17.85,20.7 CON3.P6
N$90
  Top 0.152: 24.2.P$1 18.16,24 18.8,23.37 18.8,22.73 19.18,22.35 19.18,21.16 CON3.P8
N$91
  Top 0.152: 24.1.P$1 18.67,24.77 18.67,24.26 19.18,23.75 19.18,22.86 19.56,22.48 19.56,20.57 18.98,20 CON3.P10
N$92
  Top 0.152: 23.4.P$1 21.84,23.62 21.34,23.62 20.7,22.99 20.7,22.73 19.96,21.99 19.96,20.21 CON3.P12
N$93
  Top 0.152: 23.3.P$1 21.08,22.23 20.7,22.23 20.32,21.84 20.32,19.3 19.92,18.9 CON3.P14
N$94
  Top 0.152: 23.2.P$1 21.21,20.45 20.83,20.07 20.83,19.05 20.13,18.35 CON3.P16
N$95
  Top 0.152: 23.1.P$1 22.61,21.97 22.23,21.59 22.23,20.83 21.34,19.94 21.34,18.8 20.34,17.8 CON3.P18
N$96
  Top 0.152: 22.4.P$1 25.4,20.07 24.6,20.07 24,19.77 23.39,19.16 22.38,19.16 CON3.P20
N$98
  Top 0.152: 22.3.P$1 24.12,19.18 21.73,17.64 CON3.P22
N$99
  Top 0.152: 22.2.P$1 CON3.P24
N$100
  Top 0.152: 22.1.P$1 24.81,17.45 24.26,17.45 21.48,15.6 CON3.P26
N$101
  Top 0.152: 21.4.P$1 25.91,14.6 24.95,15.56 22.25,15.56 CON3.P28
N$102
  Top 0.152: 21.3.P$1 22.29,14.73 CON3.P30
N$103
  Top 0.152: 21.2.P$1 25.53,13.97 23.75,13.97 23.37,14.35 22.77,14.35 CON3.P32
N$104
  Top 0.152: 21.1.P$1 26.42,13.46 25.91,12.95 25.15,12.95 24.51,13.59 22.88,13.59 CON3.P34
(copper drawn outside any net)
  shapes: Bottom circle x1

### Text on the board
tNames: G | G | R2 | R3 | 17 | 16 | 15 | 18 | 13 | 14 | 19 | 20 | 12 | OM2 | OM3 | 21 | 11 | 22 | 10 | 23 | 9 | 24 | R1 | R3 | G | R2 | 1 | R1 | G | 8 | 7 | OM1 | 2 | 6 | 3 | 5 | 4
bNames: Sakurai Lab | Yuma Osako